# EAGLE design ButtonI2C (EAGLE 7.5.0)
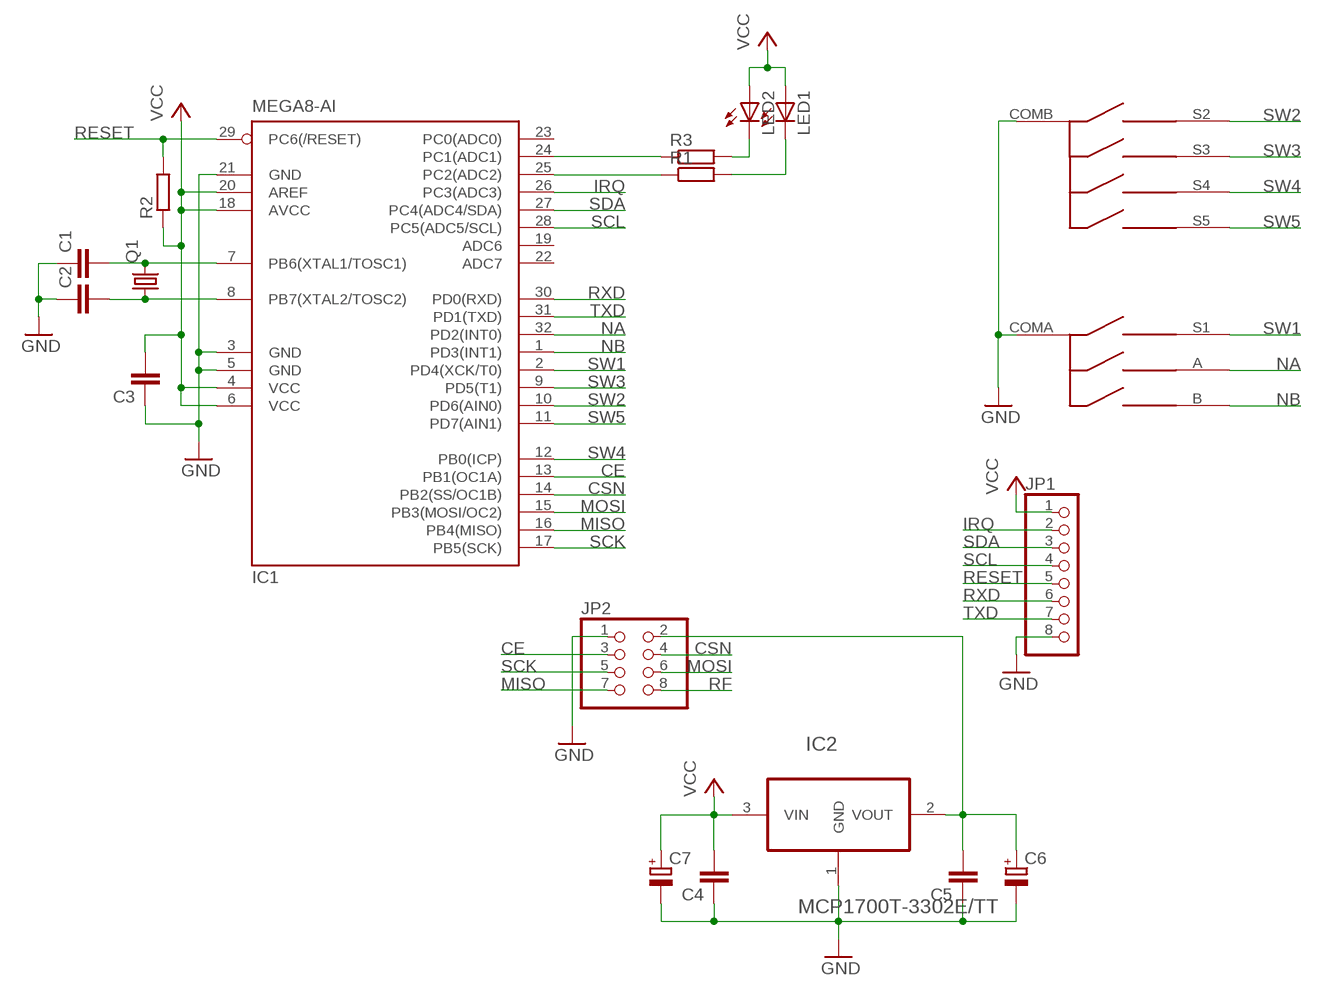
[diagram p0: schematic, sheet 1]

## Parts
C1  C-EUC0805K  [C0805K]
C2  C-EUC0805K  [C0805K]
C3  C-EUC0805K  [C0805K]
C4  C-EUC0805K  [C0805K]
C5  C-EUC0805K  [C0805K]
C6  CPOL-EUE2.5-6  [E2,5-6]
C7  CPOL-EUE2.5-6  [E2,5-6]
IC1  MEGA8-AI  [TQFP32-08]
IC2  MCP1700T-3302E/TT  [SOT95P237X112-3N]
JP1  PINHD-1X8  [1X08]
JP2  PINHD-2X4  [2X04]
LED1  LEDCHIPLED_0805  [CHIPLED_0805]
LED2  LEDCHIPLED_0805  [CHIPLED_0805]
Q1  CRYSTALHC49UP  [HC49UP]
R1  R-EU_M0805  [M0805]
R2  R-EU_M0805  [M0805]
R3  R-EU_M0805  [M0805]
U$1  ANO-I1B-M1B-O2B-S-Z  [ANO-I1B-M1B-O2B-S-Z]

## Nets
CE: IC1.13(PB1(OC1A)) JP2.3
CSN: IC1.14(PB2(SS/OC1B)) JP2.4
GND: C1.1 C2.1 C3.1 C4.1 C5.1 C6.- C7.- IC1.3(GND) IC1.5(GND) IC1.21(GND) IC2.1(GND) JP1.8 JP2.1 U$1.COMA U$1.COMB
IRQ: IC1.26(PC3(ADC3)) JP1.2
MISO: IC1.16(PB4(MISO)) JP2.7
MOSI: IC1.15(PB3(MOSI/OC2)) JP2.6
N$1: C2.2 IC1.8(PB7(XTAL2/TOSC2)) Q1.1
N$2: C1.2 IC1.7(PB6(XTAL1/TOSC1)) Q1.2
N$3: IC1.25(PC2(ADC2)) R1.1
N$4: LED1.C R1.2
N$5: LED2.C R3.2
N$6: IC1.24(PC1(ADC1)) R3.1
N$8: C5.2 C6.+ IC2.2(VOUT) JP2.2
NA: IC1.32(PD2(INT0)) U$1.A
NB: IC1.1(PD3(INT1)) U$1.B
RESET: IC1.29(PC6(/RESET)) JP1.5 R2.2
RF: JP2.8
RXD: IC1.30(PD0(RXD)) JP1.6
SCK: IC1.17(PB5(SCK)) JP2.5
SCL: IC1.28(PC5(ADC5/SCL)) JP1.4
SDA: IC1.27(PC4(ADC4/SDA)) JP1.3
SW1: IC1.2(PD4(XCK/T0)) U$1.S1
SW2: IC1.10(PD6(AIN0)) U$1.S2
SW3: IC1.9(PD5(T1)) U$1.S3
SW4: IC1.12(PB0(ICP)) U$1.S4
SW5: IC1.11(PD7(AIN1)) U$1.S5
TXD: IC1.31(PD1(TXD)) JP1.7
VCC: C3.2 C4.2 C7.+ IC1.4(VCC) IC1.6(VCC) IC1.18(AVCC) IC1.20(AREF) IC2.3(VIN) JP1.1 LED1.A LED2.A R2.1
Unconnected: IC1.19(ADC6) IC1.22(ADC7) IC1.23(PC0(ADC0))

## Library data of the parts
C1-C5 = rcl:C-EU: CAPACITOR, European symbol
C6 C7 = rcl:CPOL-EU: POLARIZED CAPACITOR, European symbol
IC1 = atmel:MEGA8: MICROCONTROLLER 8 Kbytes FLASH, 1 kbytes SRAM, 512 bytes EEPROM, USART, 6-channel 10 bit ADC, 2-channel 8 bit ADC Pin compatible with Atmega48, ATMega88, ATMega168 Source: avr.lbr; MPN: ATMEGA8-16AU; OC_FARNELL: 9171371; OC_NEWARK: 73M8863
IC2 = mylib:MCP1700T-3302E/TT: Low Quiescent Current LDO; MPN: MCP1700T-3302E/TT; OC_FARNELL: 1296592; OC_NEWARK: 88H9817; PACKAGE: SOT23-3; SUPPLIER: Microchip
JP1 = pinhead:PINHD-1X8: PIN HEADER
JP2 = pinhead:PINHD-2X4: PIN HEADER
LED1 LED2 = led:LED: LED OSRAM: - CHIPLED LG R971, LG N971, LY N971, LG Q971, LY Q971, LO R971, LY R971 LH N974, LH R974 LS Q976, LO Q976, LY Q976 LO Q996 - Hyper CHIPLED LW Q18S LB Q993, LB Q99A, LB R99A - SideLED LS A670, LO A670, LY A670, LG A670, LP A670 LB A673, LV A673, LT A673, LW A673 LH A674 LY A675 LS A676, LA A676, LO A676, LY A676, LW A676 LS A679, LY A679, LG A679 - Hyper Micro SIDELED® LS Y876, LA Y876, LO Y876, LY Y876 LT Y87S - SmartLED LW L88C, LW L88S LB L89C, LB L89S, LG L890 LS L89K, LO L89K, LY L89K LS L896, LA L896, LO L896, LY L896 - TOPLED LS T670, LO T670, LY T670, LG T670, LP T670 LSG T670, LSP T670, LSY T670, LOP T670, LYG T670 LG T671, LOG T671, LSG T671 LB T673, LV T673, LT T673, LW T673 LH T674 LS T676, LA T676, LO T676, LY T676, LB T676, LH T676, LSB T676, LW T676 LB T67C, LV T67C, LT T67C, LS T67K, LO T67K, LY T67K, LW E67C LS E67B, LA E67B, LO E67B, LY E67B, LB E67C, LV E67C, LT E67C LW T67C LS T679, LY T679, LG T679 LS T770, LO T770, LY T770, LG T770, LP T770 LB T773, LV T773, LT T773, LW T773 LH T774 LS E675, LA E675, LY E675, LS T675 LS T776, LA T776, LO T776, LY T776, LB T776 LHGB T686 LT T68C, LB T68C - Hyper Mini TOPLED® LB M676 - Mini TOPLED Santana® LG M470 LS M47K, LO M47K, LY M47K Source: http://www.osram.convergy.de LUXEON: - LUMILED® LXK2-PW12-R00, LXK2-PW12-S00, LXK2-PW14-U00, LXK2-PW14-V00 LXK2-PM12-R00, LXK2-PM12-S00, LXK2-PM14-U00 LXK2-PE12-Q00, LXK2-PE12-R00, LXK2-PE12-S00, LXK2-PE14-T00, LXK2-PE14-U00 LXK2-PB12-K00, LXK2-PB12-L00, LXK2-PB12-M00, LXK2-PB14-N00, LXK2-PB14-P00, LXK2-PB14-Q00 LXK2-PR12-L00, LXK2-PR12-M00, LXK2-PR14-Q00, LXK2-PR14-R00 LXK2-PD12-Q00, LXK2-PD12-R00, LXK2-PD12-S00 LXK2-PH12-R00, LXK2-PH12-S00 LXK2-PL12-P00, LXK2-PL12-Q00, LXK2-PL12-R00 Source: www.luxeon.com KINGBRIGHT: KA-3528ASYC Source: www.kingbright.com
Q1 = crystal:CRYSTAL: CRYSTAL; OC_FARNELL: unknown; OC_NEWARK: unknown
R1-R3 = rcl:R-EU_: RESISTOR, European symbol
U$1 = zippy:ANO-I1B-M1B-O2B-S-Z

## Board
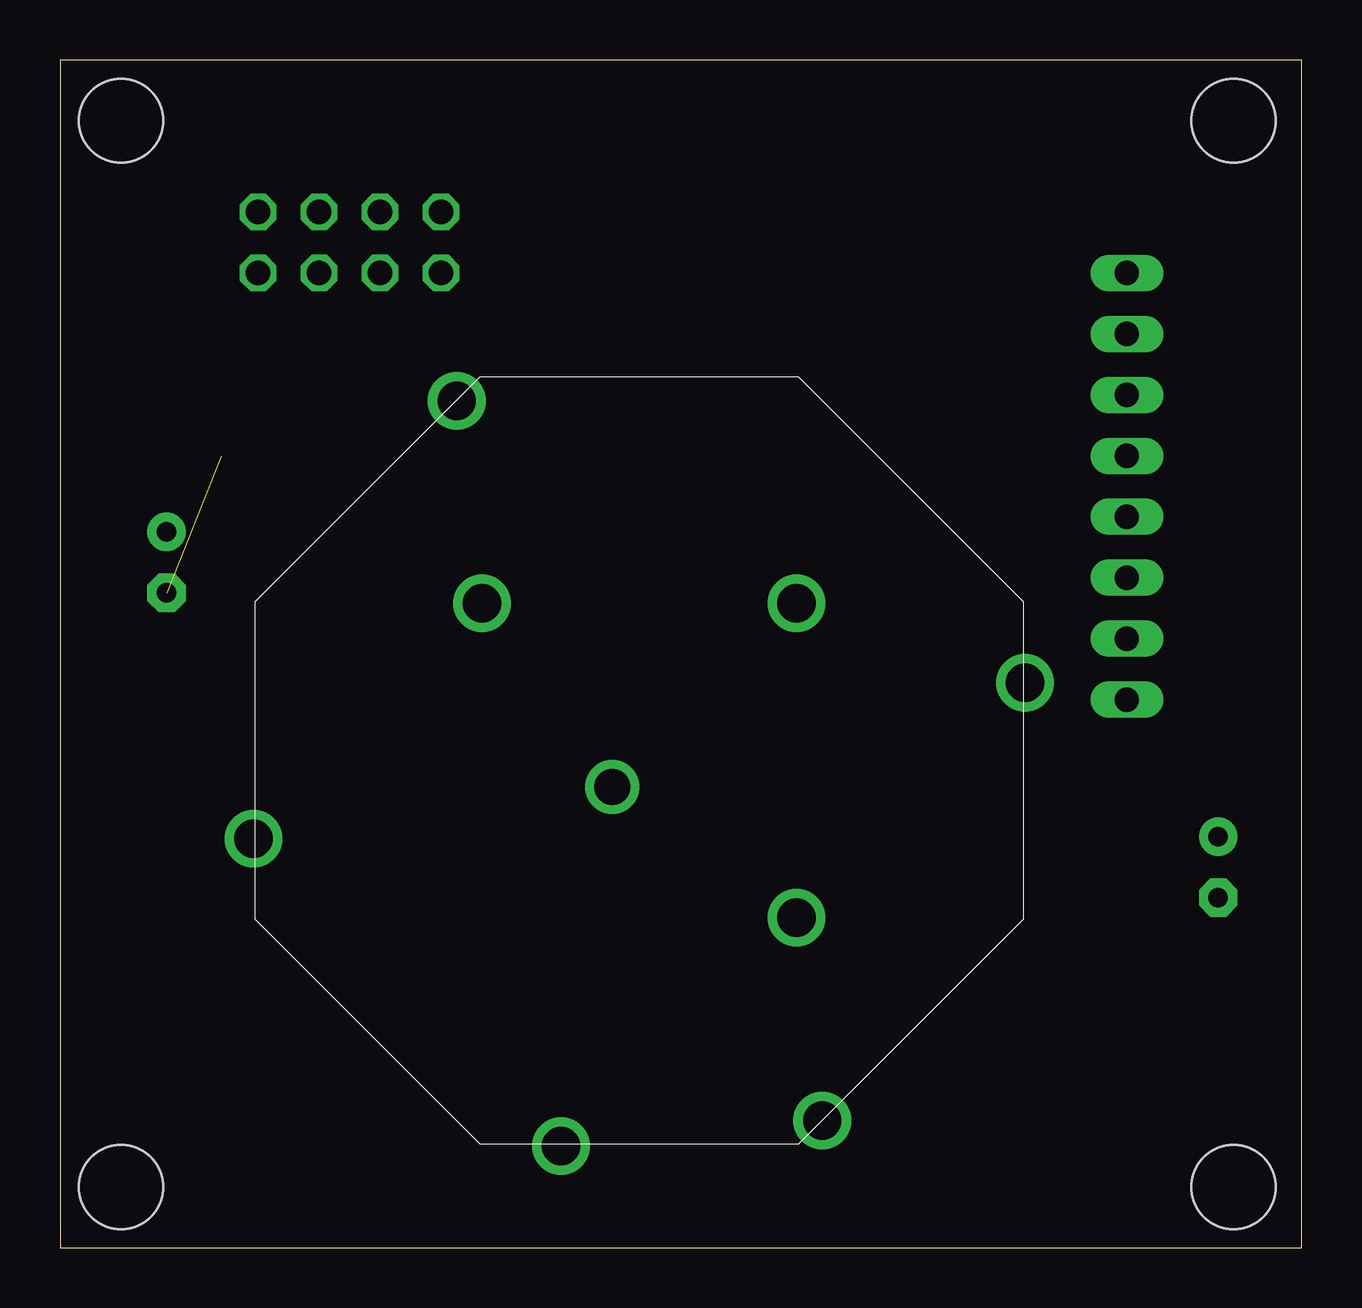
[diagram p1: board, top side]
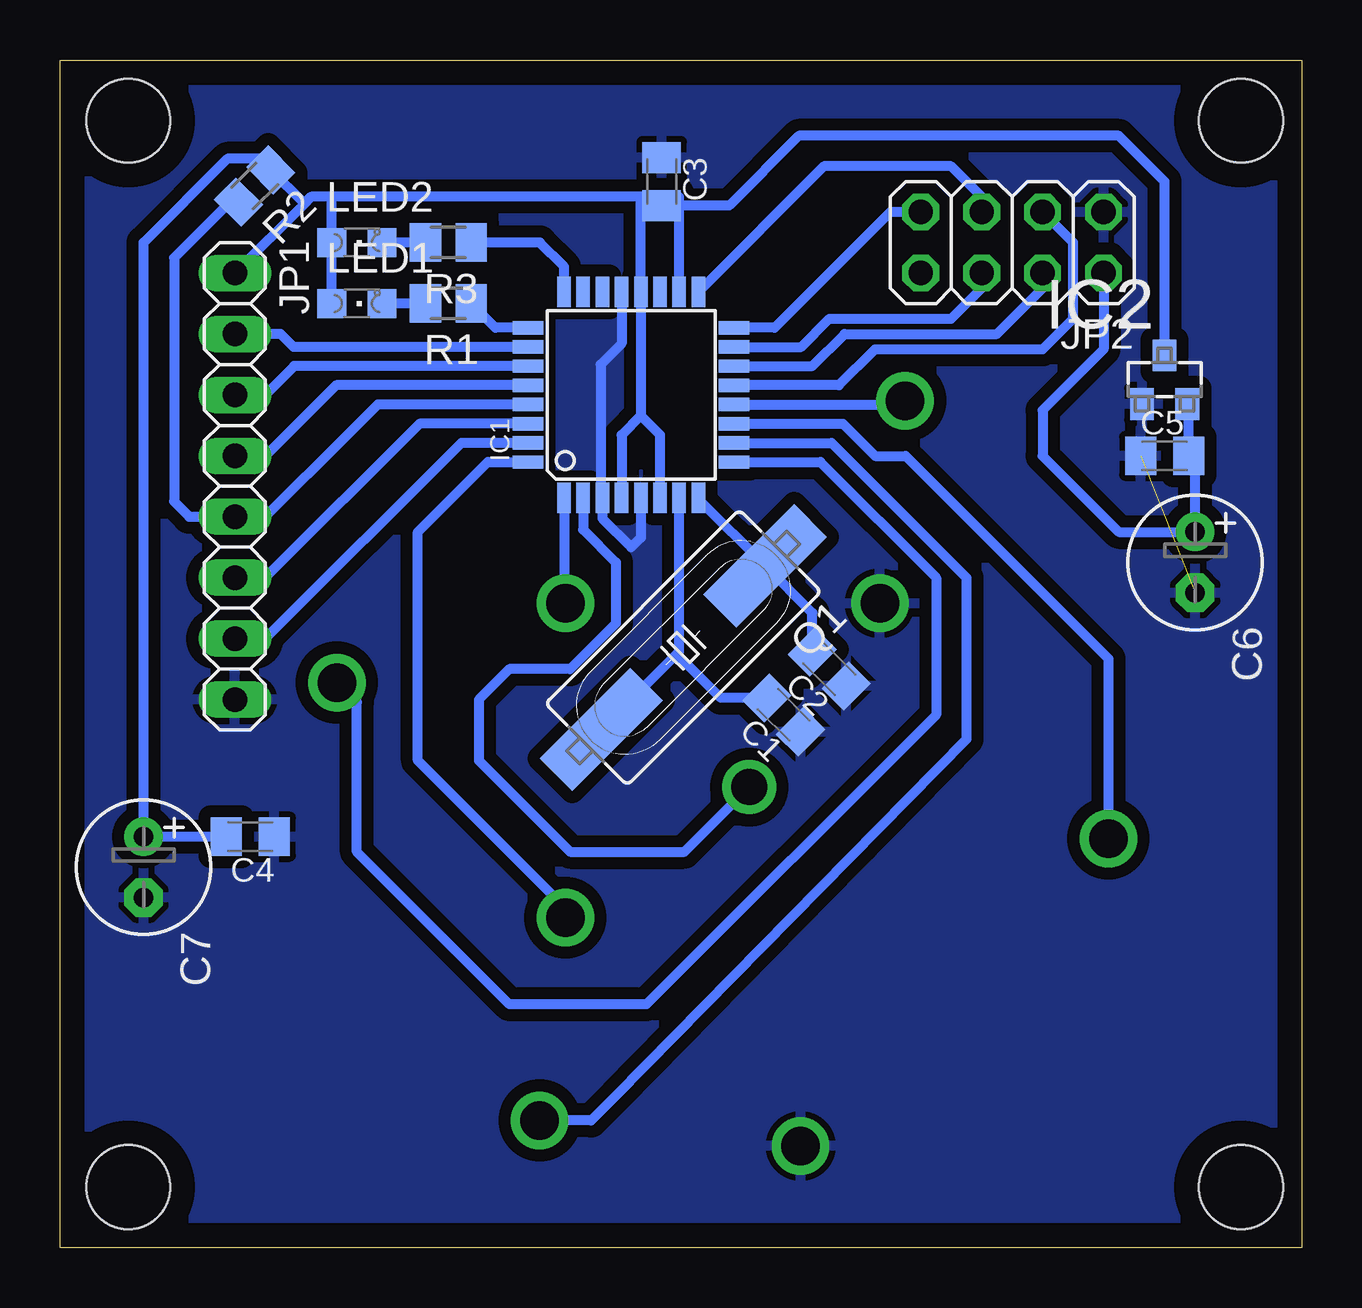
[diagram p2: board, bottom side, seen from below]

Size 51.74 x 49.52 mm. Coordinates in mm from the lower left corner, seen from the top.
Outline: 0,0 51.74,0 51.74,49.52 0,49.52 0,0
Copper layers (1*16): Top 0.035mm / dielectric 1.5mm / Bottom 0.035mm
Design rules "default": minimum track width 10mil, minimum drill 24mil, track to track 8mil, track to pad 8mil, pad to pad 8mil, via to via 8mil, smd to smd 8mil, copper to edge 40mil, drill to drill 8mil, minimum pad ring 10mil, minimum via ring 8mil, stop-mask expansion 4mil, vias tented up to drill 0mil, thermal gap 10mil
Holes 3.5 mm at 2.54,46.99 2.54,2.54 48.9,2.54 48.9,46.99

### Footprints (pad centres in the part's own frame; a part is rotated, then mirrored left to right if it is on the bottom)
C0805K = smd 1.3 x 1.6: 1 -1,0; 2 1,0
E2,5-6 = drill 0.813 pad 1.6: + -1.27,0 | drill 0.813 pad 1.6 octagon: - 1.27,0
TQFP32-08 = smd 1.27 x 0.559: 1 -4.293,2.8; 2 -4.293,2; 3 -4.293,1.2; 4 -4.293,0.4; 5 -4.293,-0.4; 6 -4.293,-1.2; 7 -4.293,-2; 8 -4.293,-2.8; 17 4.293,-2.8; 18 4.293,-2; 19 4.293,-1.2; 20 4.293,-0.4; 21 4.293,0.4; 22 4.293,1.2; 23 4.293,2; 24 4.293,2.8 | smd 0.559 x 1.27: 9 -2.8,-4.293; 10 -2,-4.293; 11 -1.2,-4.293; 12 -0.4,-4.293; 13 0.4,-4.293; 14 1.2,-4.293; 15 2,-4.293; 16 2.8,-4.293; 25 2.8,4.293; 26 2,4.293; 27 1.2,4.293; 28 0.4,4.293; 29 -0.4,4.293; 30 -1.2,4.293; 31 -2,4.293; 32 -2.8,4.293
SOT95P237X112-3N = smd 0.991 x 1.321: 1 -0.94,-1.016; 2 0.94,-1.016; 3 0,1.016
1X08 = drill 1.016 long: 1 -8.89,0; 2 -6.35,0; 3 -3.81,0; 4 -1.27,0; 5 1.27,0; 6 3.81,0; 7 6.35,0; 8 8.89,0
2X04 = drill 1.016 octagon: 1 -3.81,-1.27; 2 -3.81,1.27; 3 -1.27,-1.27; 4 -1.27,1.27; 5 1.27,-1.27; 6 1.27,1.27; 7 3.81,-1.27; 8 3.81,1.27
CHIPLED_0805 = smd 1.2 x 1.2: A 0,-1.05; C 0,1.05
HC49UP = smd 5.334 x 1.93: 1 -4.826,0; 2 4.826,0
M0805 = smd 1.3 x 1.6: 1 -0.95,0; 2 0.95,0
ANO-I1B-M1B-O2B-S-Z = drill 1.6: A 6.55,-6.55; B 6.55,6.55; COMA -6.55,6.55; COMB -3.25,-16.07; S2 7.63,-15; S3 16.07,3.25; S4 -7.6,15; S5 -16.07,-3.25 | drill 1.5: S1 -1.11,-1.11

### Placement (x,y rotation side)
C1  21.59,22.23 135 bottom
C2  19.68,24.13 135 bottom
C3  26.67,44.45 270 bottom
C4  43.81,17.14 180 bottom
C5  5.71,33.02 0 bottom
C6  4.45,28.57 270 bottom
C7  48.26,15.88 270 bottom
IC1  27.94,35.56 90 bottom
IC2  5.71,36.2 0 bottom
JP1  44.45,31.75 270 bottom
JP2  12.06,41.91 180 bottom
LED1  39.37,39.37 270 bottom
LED2  39.37,41.91 270 bottom
Q1  25.77,25.03 225 bottom
R1  35.56,39.37 180 bottom
R2  43.63,44.26 225 bottom
R3  35.56,41.91 180 bottom
U$1  24.13,20.32 0 top

### Tracks (layer width: path | path; a pad name or v marks a point on that pad's centre or on a via)
CE
  Bottom 0.406: IC1.13 19.29,35.96 17.78,37.47 10.79,37.47 9.53,38.73 9.53,41.91 JP2.3
CSN
  Bottom 0.406: IC1.14 20.39,36.76 19.05,38.1 12.7,38.1 10.79,40.01 JP2.4
GND  (1 unrouted)
  Bottom 0.406: IC1.5 27.54,29.61 27.94,29.21 29.14,30.41 IC1.3 29.21,31.34 29.21,36.83 28.34,37.7 IC1.21
  pour Bottom (isolate 0.508): 0,49.53 52.07,49.53 52.07,0 0,0
IRQ
  Bottom 0.406: IC1.26 42.01,37.56 42.55,38.1 JP1.2
MISO
  Bottom 0.406: IC1.16 21.96,38.36 17.14,43.18 JP2.7
MOSI
  Bottom 0.406: IC1.15 20.86,37.56 19.68,38.73 14.61,38.73 13.34,40.01 JP2.6
N$1
  Bottom 0.406: C2.2 20.39,26.47 Q1.1 25.14,31.22 IC1.8
N$2
  Bottom 0.406: Q1.2 | Q1.2 26.04,24.77 | 26.04,24.77 25.94,24.86 IC1.7 | C1.2 24.2,22.93 26.04,24.77
N$3
  Bottom 0.406: IC1.25 33.6,38.36 R1.1
N$4
  Bottom 0.406: R1.2 LED1.C
N$5
  Bottom 0.406: R3.2 LED2.C
N$6
  Bottom 0.406: IC1.24 30.74,40.9 31.75,41.91 R3.1
N$8
  Bottom 0.406: JP2.2 8.26,37.47 10.79,34.92 10.79,33.02 7.62,29.84 C6.+ 4.45,32.75 C5.2 4.71,35.12 IC2.2
NA
  Bottom 0.406: U$1.A 30.68,14.17 36.83,20.32 36.83,29.84 33.91,32.76 IC1.32
NB
  Bottom 0.406: IC1.1 30.74,26.93 U$1.B
RESET
  Bottom 0.406: IC1.29 38.5,35.16 39.75,33.91 | 39.75,33.91 | 39.75,33.91 43.18,30.48 JP1.5 46.35,30.48 46.99,31.11 46.99,41.27 44.67,43.59 R2.2
RXD
  Bottom 0.406: IC1.30 36.76,34.36 43.18,27.94 JP1.6
SCK
  Bottom 0.406: IC1.17 19.91,45.09 14.61,45.09 13.34,43.81 JP2.5
SCL
  Bottom 0.406: IC1.28 40.24,35.96 43.18,33.02 JP1.4
SDA
  Bottom 0.406: IC1.27 41.98,36.76 43.18,35.56 JP1.3
SW1
  Bottom 0.406: IC1.2 29.94,29.94 28.57,28.57 28.57,26.04 30.48,24.13 33.02,24.13 34.29,22.86 34.29,20.32 30.48,16.51 25.72,16.51 U$1.S1
SW2
  Bottom 0.406: IC1.10 19.59,33.56 13.97,27.94 13.97,21.2 28.57,6.35 29.61,5.32 U$1.S2
SW3
  Bottom 0.406: IC1.9 20.06,32.76 15.24,27.94 15.24,22.23 27.3,10.16 33.02,10.16 39.37,16.51 39.37,22.74 U$1.S3
SW4
  Bottom 0.406: IC1.12 16.69,35.16 U$1.S4
SW5
  Bottom 0.406: IC1.11 19.12,34.36 17.78,33.02 16.51,33.02 8.06,24.57 U$1.S5
TXD
  Bottom 0.406: IC1.31 35.02,33.56 43.18,25.4 JP1.7
VCC
  Bottom 0.406: 27.54,34.69 IC1.20 27.54,43.81 | 27.54,34.69 28.34,33.89 IC1.4 | IC1.18 25.94,43.81 26.67,43.81 | 27.54,43.81 40.42,43.81 | 40.42,43.81 41.27,43.81 41.59,43.5 | IC1.6 26.74,33.89 27.54,34.69 | 41.59,43.5 JP1.1 44.72,40.37 | 26.67,43.81 27.54,43.81 | LED1.A LED2.A 40.42,43.81 | 26.67,43.81 C3.2 23.86,43.45 20.95,46.35 7.62,46.35 5.71,44.45 IC2.3 | 41.59,43.5 41.59,43.57 R2.1 43.42,45.4 44.77,45.4 48.26,41.91 C7.+ C4.2